# Altium schematic sheet STM32_MCU.SchDoc
size A2
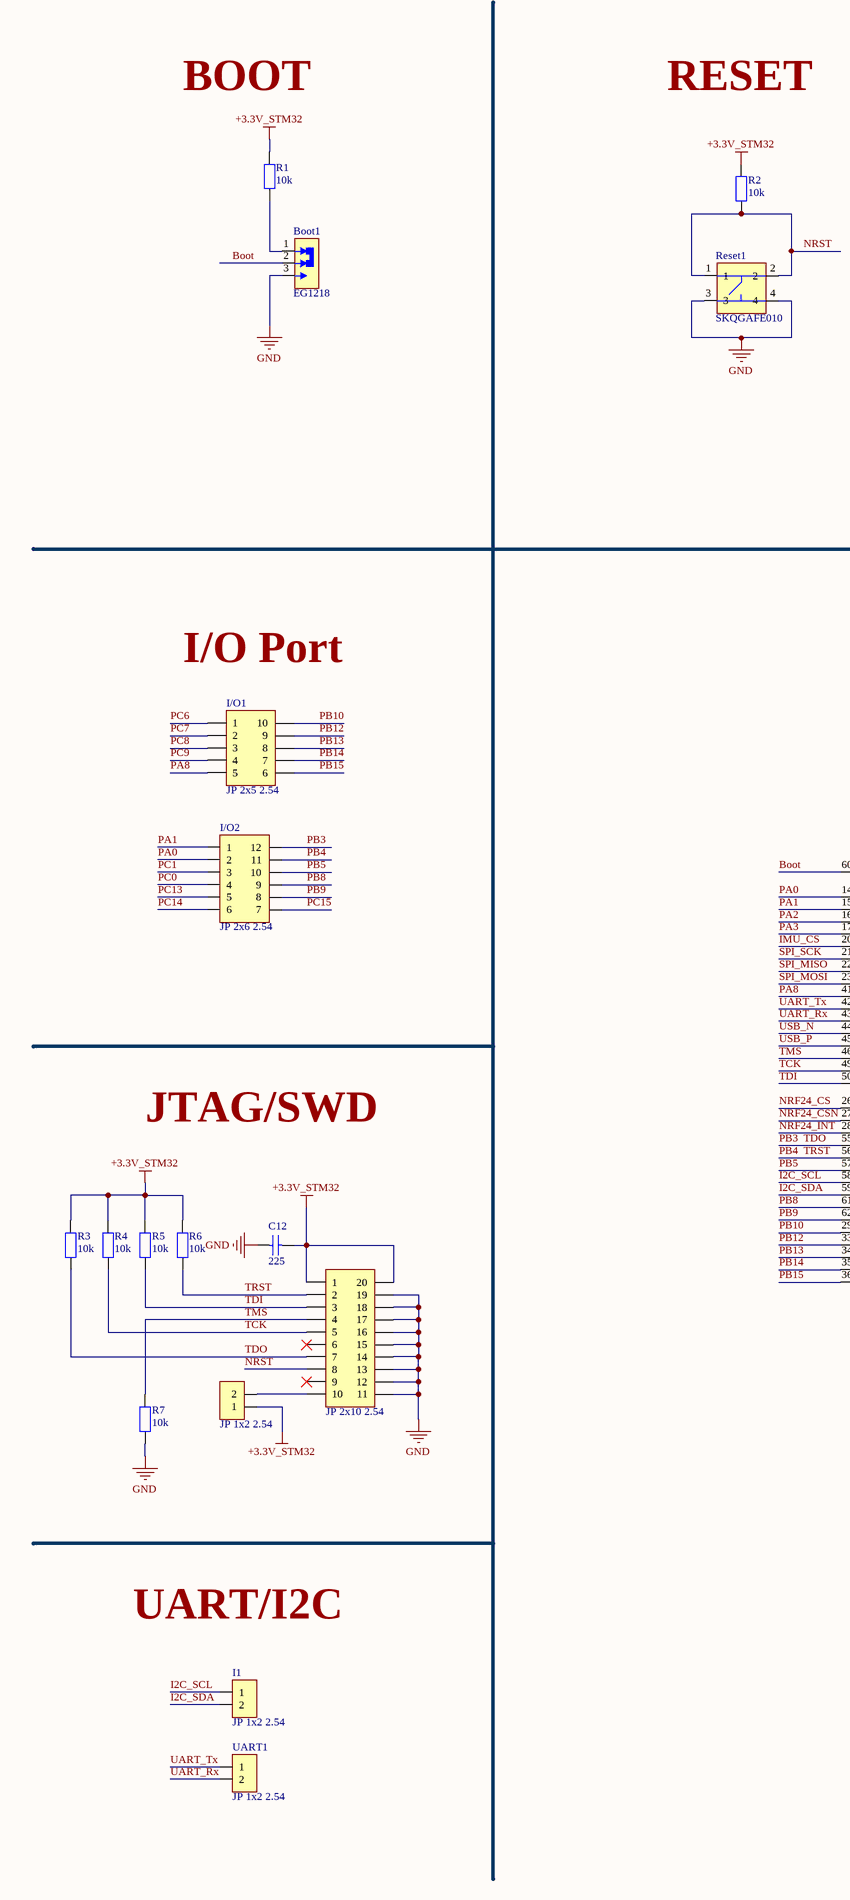
[diagram p0: STM32_MCU.SchDoc, left]
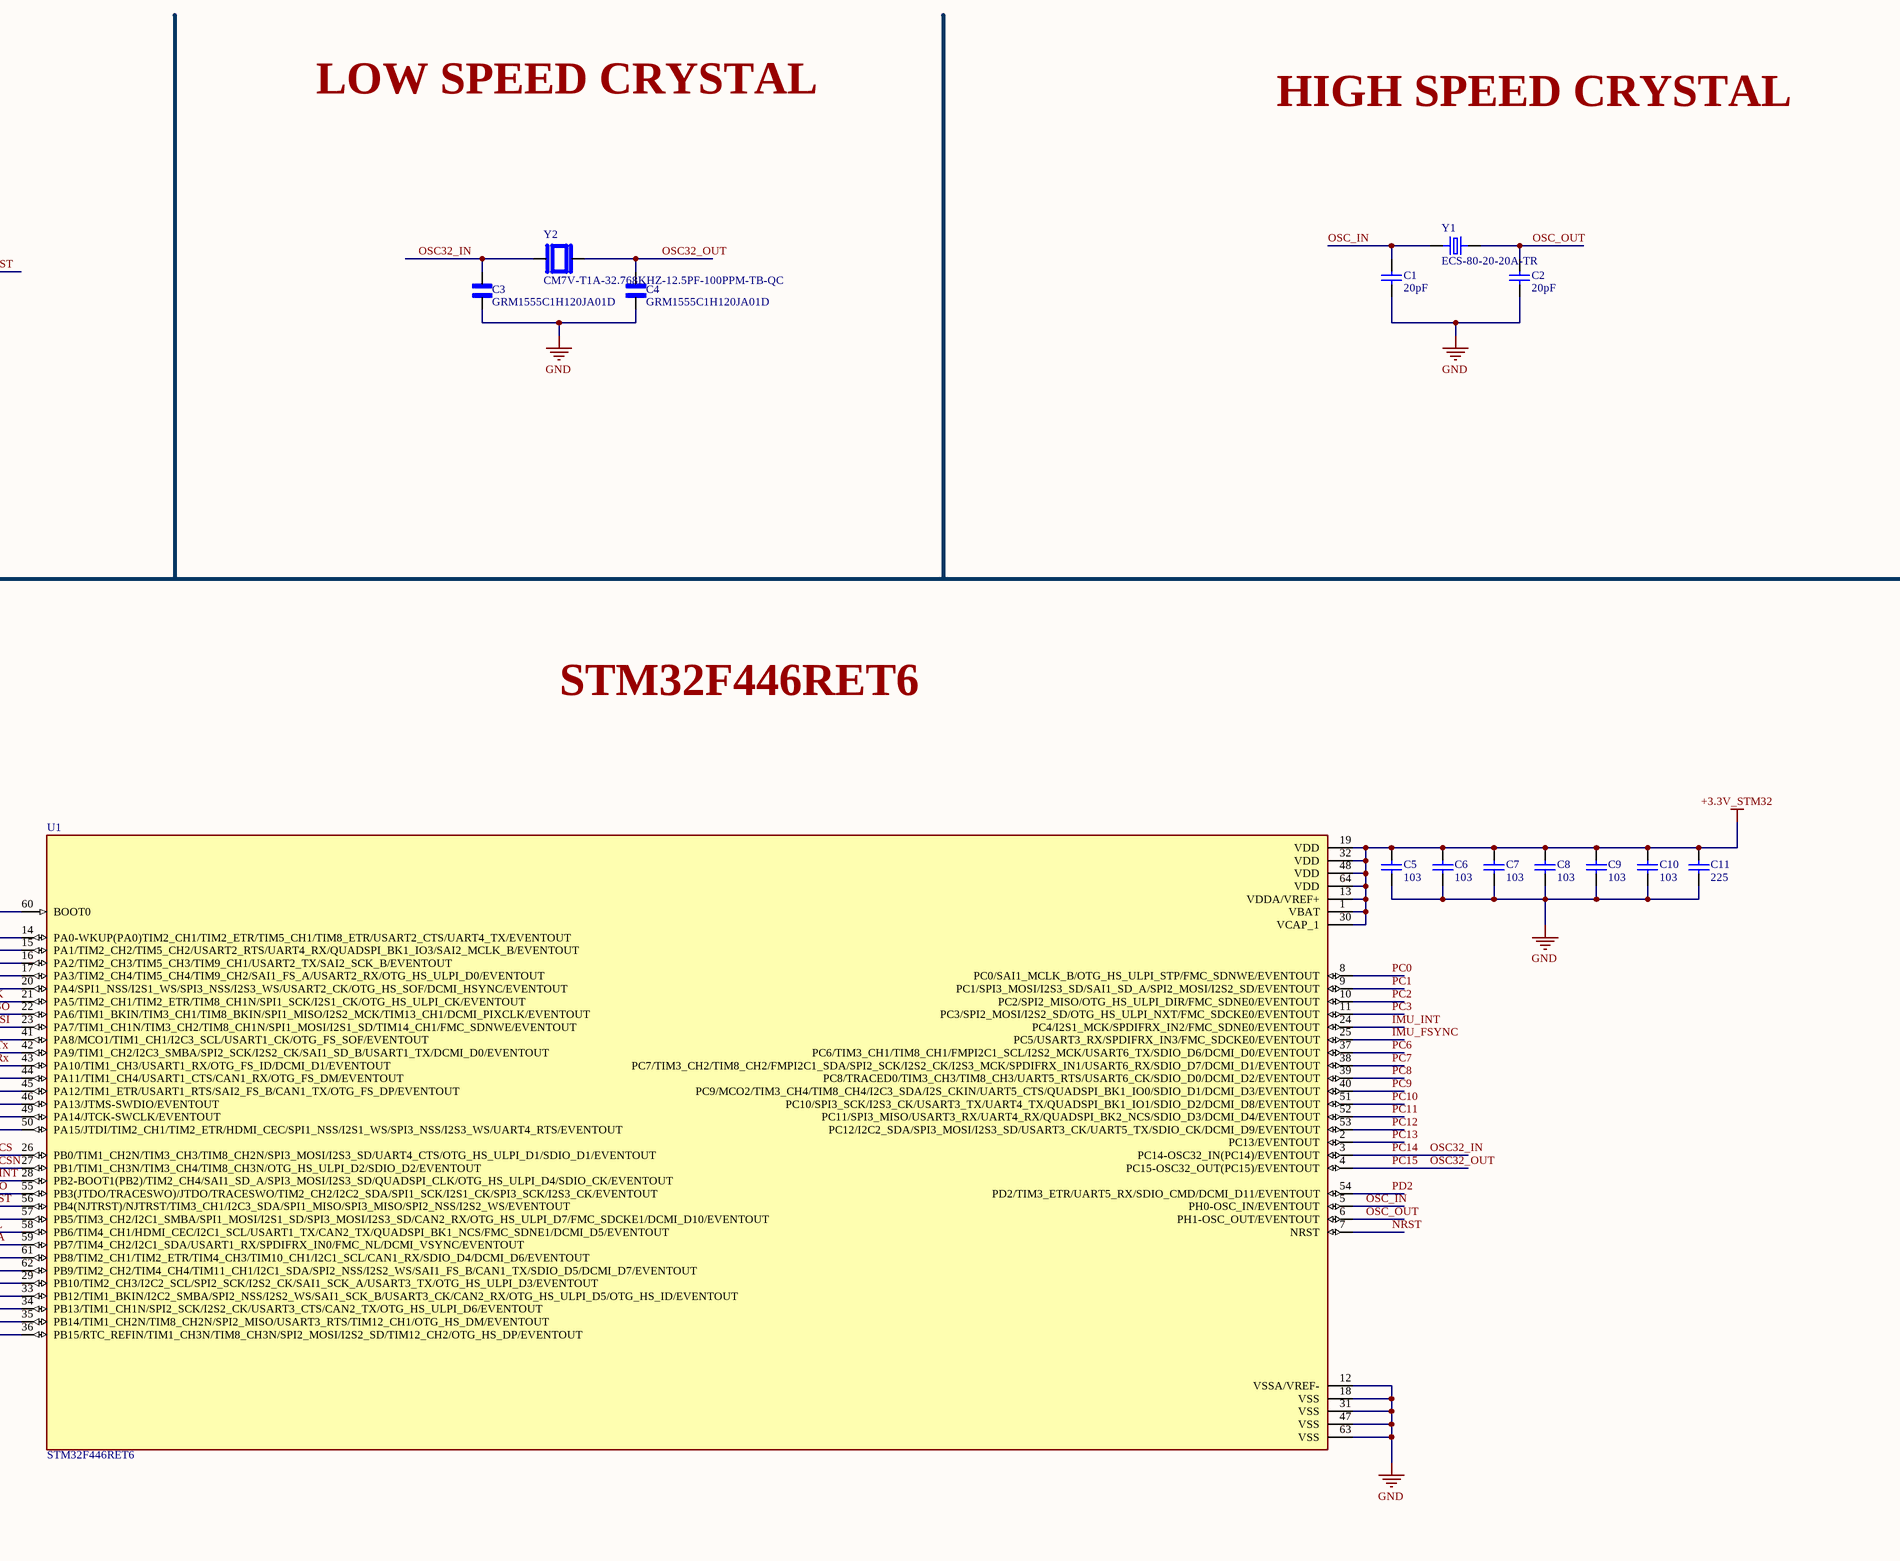
[diagram p1: STM32_MCU.SchDoc, right]

## Parts
Boot1  EG1218  [SW_EG1218]
C1  20pF  [tu 0805]
C2  20pF  [tu 0805]
C3  GRM1555C1H120JA01D  [CAPC1005X55N]
C4  GRM1555C1H120JA01D  [CAPC1005X55N]
C5  103  [tu 0603]
C6  103  [tu 0603]
C7  103  [tu 0603]
C8  103  [tu 0603]
C9  103  [tu 0603]
C10  103  [tu 0603]
C11  225  [tu 0805]
C12  225  [tu 0805]
I1  JP 1x2 2.54  [JP 1x2 DT]
I/O1  JP 2x5 2.54  [JP 2x5 DT]
I/O2  JP 2x6 2.54  [JP 2x6 DT]
JP1  JP 1x2 2.54  [JP 1x2 DT]
R1  10k  [tro smd 0603]
R2  10k  [tro smd 0603]
R3  10k  [tro smd 0603]
R4  10k  [tro smd 0603]
R5  10k  [tro smd 0603]
R6  10k  [tro smd 0603]
R7  10k  [tro smd 0603]
Reset1  SKQGAFE010  [SW_SKQGAFE010]
SWD/JTAG1  JP 2x10 2.54  [JP 2x10 DT]
U1  STM32F446RET6  [QFP50P1200X1200X160-64N]
UART1  JP 1x2 2.54  [JP 1x2 DT]
Y1  ECS-80-20-20A-TR  [XTAL_ECS-80-20-20A-TR]
Y2  CM7V-T1A-32.768KHZ-12.5PF-100PPM-TB-QC  [XTAL_CM7V-T1A-32.768KHZ-12.5PF-100PPM-TB-QC]

## Nets
+3.3V_STM32: C5.1 C6.1 C7.1 C8.1 C9.1 C10.1 C11.1 C12.1 JP1.1 R1.2 R2.2 R3.2 R4.2 R5.2 R6.2 SWD/JTAG1.1 SWD/JTAG1.20 U1.1(VBAT) U1.13(VDDA/VREF+) U1.19(VDD) U1.30(VCAP_1) U1.32(VDD) U1.48(VDD) U1.64(VDD)
GND: Boot1.3(NO) C1.2 C2.2 C3.1 C4.1 C5.2 C6.2 C7.2 C8.2 C9.2 C10.2 C11.2 C12.2 R7.1 Reset1.3 Reset1.4 SWD/JTAG1.11 SWD/JTAG1.12 SWD/JTAG1.13 SWD/JTAG1.14 SWD/JTAG1.15 SWD/JTAG1.16 SWD/JTAG1.17 SWD/JTAG1.18 SWD/JTAG1.19 U1.12(VSSA/VREF-) U1.18(VSS) U1.31(VSS) U1.47(VSS) U1.63(VSS)
Boot: Boot1.2(COM) U1.60(BOOT0)
I2C_SCL: I1.1 U1.58(PB6/TIM4_CH1/HDMI_CEC/I2C1_SCL/USART1_TX/CAN2_TX/QUADSPI_BK1_NCS/FMC_SDNE1/DCMI_D5/EVENTOUT)
I2C_SDA: I1.2 U1.59(PB7/TIM4_CH2/I2C1_SDA/USART1_RX/SPDIFRX_IN0/FMC_NL/DCMI_VSYNC/EVENTOUT)
IMU_CS: U1.20(PA4/SPI1_NSS/I2S1_WS/SPI3_NSS/I2S3_WS/USART2_CK/OTG_HS_SOF/DCMI_HSYNC/EVENTOUT)
IMU_FSYNC: U1.25(PC5/USART3_RX/SPDIFRX_IN3/FMC_SDCKE0/EVENTOUT)
IMU_INT: U1.24(PC4/I2S1_MCK/SPDIFRX_IN2/FMC_SDNE0/EVENTOUT)
NRF24_CS: U1.26(PB0/TIM1_CH2N/TIM3_CH3/TIM8_CH2N/SPI3_MOSI/I2S3_SD/UART4_CTS/OTG_HS_ULPI_D1/SDIO_D1/EVENTOUT)
NRF24_CSN: U1.27(PB1/TIM1_CH3N/TIM3_CH4/TIM8_CH3N/OTG_HS_ULPI_D2/SDIO_D2/EVENTOUT)
NRF24_INT: U1.28(PB2-BOOT1(PB2)/TIM2_CH4/SAI1_SD_A/SPI3_MOSI/I2S3_SD/QUADSPI_CLK/OTG_HS_ULPI_D4/SDIO_CK/EVENTOUT)
NRST: R2.1 Reset1.1 Reset1.2 SWD/JTAG1.8 U1.7(NRST)
OSC32_IN: C3.2 I/O2.6 U1.3(PC14-OSC32_IN(PC14)/EVENTOUT) Y2.1  [also labelled PC14]
OSC32_OUT: C4.2 I/O2.7 U1.4(PC15-OSC32_OUT(PC15)/EVENTOUT) Y2.2  [also labelled PC15]
OSC_IN: C1.1 U1.5(PH0-OSC_IN/EVENTOUT) Y1.1
OSC_OUT: C2.1 U1.6(PH1-OSC_OUT/EVENTOUT) Y1.2
PA0: I/O2.2 U1.14(PA0-WKUP(PA0)TIM2_CH1/TIM2_ETR/TIM5_CH1/TIM8_ETR/USART2_CTS/UART4_TX/EVENTOUT)
PA1: I/O2.1 U1.15(PA1/TIM2_CH2/TIM5_CH2/USART2_RTS/UART4_RX/QUADSPI_BK1_IO3/SAI2_MCLK_B/EVENTOUT)
PA2: U1.16(PA2/TIM2_CH3/TIM5_CH3/TIM9_CH1/USART2_TX/SAI2_SCK_B/EVENTOUT)
PA3: U1.17(PA3/TIM2_CH4/TIM5_CH4/TIM9_CH2/SAI1_FS_A/USART2_RX/OTG_HS_ULPI_D0/EVENTOUT)
PA8: I/O1.5 U1.41(PA8/MCO1/TIM1_CH1/I2C3_SCL/USART1_CK/OTG_FS_SOF/EVENTOUT)
PB3: I/O2.12 R3.1 SWD/JTAG1.7 U1.55(PB3(JTDO/TRACESWO)/JTDO/TRACESWO/TIM2_CH2/I2C2_SDA/SPI1_SCK/I2S1_CK/SPI3_SCK/I2S3_CK/EVENTOUT)  [also labelled TDO]
PB4: I/O2.11 R6.1 SWD/JTAG1.2 U1.56(PB4(NJTRST)/NJTRST/TIM3_CH1/I2C3_SDA/SPI1_MISO/SPI3_MISO/SPI2_NSS/I2S2_WS/EVENTOUT)  [also labelled TRST]
PB5: I/O2.10 U1.57(PB5/TIM3_CH2/I2C1_SMBA/SPI1_MOSI/I2S1_SD/SPI3_MOSI/I2S3_SD/CAN2_RX/OTG_HS_ULPI_D7/FMC_SDCKE1/DCMI_D10/EVENTOUT)
PB8: I/O2.9 U1.61(PB8/TIM2_CH1/TIM2_ETR/TIM4_CH3/TIM10_CH1/I2C1_SCL/CAN1_RX/SDIO_D4/DCMI_D6/EVENTOUT)
PB9: I/O2.8 U1.62(PB9/TIM2_CH2/TIM4_CH4/TIM11_CH1/I2C1_SDA/SPI2_NSS/I2S2_WS/SAI1_FS_B/CAN1_TX/SDIO_D5/DCMI_D7/EVENTOUT)
PB10: I/O1.10 U1.29(PB10/TIM2_CH3/I2C2_SCL/SPI2_SCK/I2S2_CK/SAI1_SCK_A/USART3_TX/OTG_HS_ULPI_D3/EVENTOUT)
PB12: I/O1.9 U1.33(PB12/TIM1_BKIN/I2C2_SMBA/SPI2_NSS/I2S2_WS/SAI1_SCK_B/USART3_CK/CAN2_RX/OTG_HS_ULPI_D5/OTG_HS_ID/EVENTOUT)
PB13: I/O1.8 U1.34(PB13/TIM1_CH1N/SPI2_SCK/I2S2_CK/USART3_CTS/CAN2_TX/OTG_HS_ULPI_D6/EVENTOUT)
PB14: I/O1.7 U1.35(PB14/TIM1_CH2N/TIM8_CH2N/SPI2_MISO/USART3_RTS/TIM12_CH1/OTG_HS_DM/EVENTOUT)
PB15: I/O1.6 U1.36(PB15/RTC_REFIN/TIM1_CH3N/TIM8_CH3N/SPI2_MOSI/I2S2_SD/TIM12_CH2/OTG_HS_DP/EVENTOUT)
PC0: I/O2.4 U1.8(PC0/SAI1_MCLK_B/OTG_HS_ULPI_STP/FMC_SDNWE/EVENTOUT)
PC1: I/O2.3 U1.9(PC1/SPI3_MOSI/I2S3_SD/SAI1_SD_A/SPI2_MOSI/I2S2_SD/EVENTOUT)
PC2: U1.10(PC2/SPI2_MISO/OTG_HS_ULPI_DIR/FMC_SDNE0/EVENTOUT)
PC3: U1.11(PC3/SPI2_MOSI/I2S2_SD/OTG_HS_ULPI_NXT/FMC_SDCKE0/EVENTOUT)
PC6: I/O1.1 U1.37(PC6/TIM3_CH1/TIM8_CH1/FMPI2C1_SCL/I2S2_MCK/USART6_TX/SDIO_D6/DCMI_D0/EVENTOUT)
PC7: I/O1.2 U1.38(PC7/TIM3_CH2/TIM8_CH2/FMPI2C1_SDA/SPI2_SCK/I2S2_CK/I2S3_MCK/SPDIFRX_IN1/USART6_RX/SDIO_D7/DCMI_D1/EVENTOUT)
PC8: I/O1.3 U1.39(PC8/TRACED0/TIM3_CH3/TIM8_CH3/UART5_RTS/USART6_CK/SDIO_D0/DCMI_D2/EVENTOUT)
PC9: I/O1.4 U1.40(PC9/MCO2/TIM3_CH4/TIM8_CH4/I2C3_SDA/I2S_CKIN/UART5_CTS/QUADSPI_BK1_IO0/SDIO_D1/DCMI_D3/EVENTOUT)
PC10: U1.51(PC10/SPI3_SCK/I2S3_CK/USART3_TX/UART4_TX/QUADSPI_BK1_IO1/SDIO_D2/DCMI_D8/EVENTOUT)
PC11: U1.52(PC11/SPI3_MISO/USART3_RX/UART4_RX/QUADSPI_BK2_NCS/SDIO_D3/DCMI_D4/EVENTOUT)
PC12: U1.53(PC12/I2C2_SDA/SPI3_MOSI/I2S3_SD/USART3_CK/UART5_TX/SDIO_CK/DCMI_D9/EVENTOUT)
PC13: I/O2.5 U1.2(PC13/EVENTOUT)
PD2: U1.54(PD2/TIM3_ETR/UART5_RX/SDIO_CMD/DCMI_D11/EVENTOUT)
SPI_MISO: U1.22(PA6/TIM1_BKIN/TIM3_CH1/TIM8_BKIN/SPI1_MISO/I2S2_MCK/TIM13_CH1/DCMI_PIXCLK/EVENTOUT)
SPI_MOSI: U1.23(PA7/TIM1_CH1N/TIM3_CH2/TIM8_CH1N/SPI1_MOSI/I2S1_SD/TIM14_CH1/FMC_SDNWE/EVENTOUT)
SPI_SCK: U1.21(PA5/TIM2_CH1/TIM2_ETR/TIM8_CH1N/SPI1_SCK/I2S1_CK/OTG_HS_ULPI_CK/EVENTOUT)
TCK: R4.1 SWD/JTAG1.5 U1.49(PA14/JTCK-SWCLK/EVENTOUT)
TDI: R5.1 SWD/JTAG1.3 U1.50(PA15/JTDI/TIM2_CH1/TIM2_ETR/HDMI_CEC/SPI1_NSS/I2S1_WS/SPI3_NSS/I2S3_WS/UART4_RTS/EVENTOUT)
TMS: R7.2 SWD/JTAG1.4 U1.46(PA13/JTMS-SWDIO/EVENTOUT)
UART_Rx: U1.43(PA10/TIM1_CH3/USART1_RX/OTG_FS_ID/DCMI_D1/EVENTOUT) UART1.2
UART_Tx: U1.42(PA9/TIM1_CH2/I2C3_SMBA/SPI2_SCK/I2S2_CK/SAI1_SD_B/USART1_TX/DCMI_D0/EVENTOUT) UART1.1
USB_N: U1.44(PA11/TIM1_CH4/USART1_CTS/CAN1_RX/OTG_FS_DM/EVENTOUT)
USB_P: U1.45(PA12/TIM1_ETR/USART1_RTS/SAI2_FS_B/CAN1_TX/OTG_FS_DP/EVENTOUT)
NetBoot1_1: Boot1.1(NC) R1.1
NetJP1_2: JP1.2 SWD/JTAG1.10

Not connected (* = marked no-connect by the designer): SWD/JTAG1 6* 9*

## Notes on the sheet
- BOOT
- RESET
- LOW SPEED CRYSTAL
- HIGH SPEED CRYSTAL
- I/O Port
- STM32F446RET6
- JTAG/SWD
- UART/I2C
- Title
- Size:
- Date:
- File:
- A2
- Number:
- Time:
- Revision:
- Sheet
- of

## Library data of the parts
Boot1 = EG1218: Slide Switch, EG Series, SPDT, Non-Shorting, ON-ON, 200mA DC, 30VDC, PC Pin | E-Switch EG1218; SnapEDA_Link: https://www.snapeda.com/parts/EG1218/E-Switch/view-part/?ref=snap; Package: None; Value: *; MF: E-Switch; MP: EG1218; Check_prices: https://www.snapeda.com/parts/EG1218/E-Switch/view-part/?ref=eda
C1 C2 = Tu 0805 20pF 50V 10%: Dán; Don_Vi: Con; Ten_Linh_Kien: Tụ 0805 20P 10% 50V; So_Chan: 2; Ma_Hang: MH004558; Chung_Loai: Dán; Kieu_Chan: *
C3 C4 = GRM1555C1H120JA01D: 0402 12 pF 50 V Â±5% Tolerance C0G SMT Multilayer Ceramic Capacitor; MF: {'manufacturer': u'Murata'}; Package: None; Price: None; Value: *; MP: GRM1555C1H120JA01D; Availability: Unavailable
C5-C10 = Tu 0603 103 50V 10%: Dán; Don_Vi: Con; So_Chan: 2; Ten_Linh_Kien: Tụ 0603 103-10nF 10% 50V; Ma_Hang: MH004567; Chung_Loai: Dán; Kieu_Chan: *
C11 C12 = Tu 0805 225 25V 10%: Dán; Don_Vi: Con; So_Chan: 2; Ten_Linh_Kien: Tụ 0805 225-2.2uF 25V 10%; Ma_Hang: MH007483; Chung_Loai: Dán; Kieu_Chan: *
I1 JP1 UART1 = JP 1x2 2.54 Duc Thang: Cắm; Ten_Linh_Kien: Jump Đơn Đực 2.54MM 1x40P Thẳng 11MM; Don_Vi: Con; Ma_Hang: MH000903; Ghi_Chu: *; Kieu_Chan: *; Chung_Loai: Cắm
I/O1 = JP 2x5 2.54 Duc Thang: Cắm; Ten_Linh_Kien: Jump Đôi Đực 2.54MM 2x40P Thẳng 11MM; Don_Vi: Con; Ma_Hang: MH002686; Ghi_Chu: *; Kieu_Chan: *; Chung_Loai: Cắm
I/O2 = JP 2x6 2.54 Duc Thang: Cắm; Ten_Linh_Kien: Jump Đôi Đực 2.54MM 2x40P Thẳng 11MM; Don_Vi: Con; Ma_Hang: MH002686; Ghi_Chu: *; Kieu_Chan: *; Chung_Loai: Cắm
R1-R7 = Tro 0603 1% 10k: Dán; Don_Vi: Con; So_Chan: 2; Ten_Linh_Kien: Trở 0603 1% 10k; Ma_Hang: MH006333; Chung_Loai: Dán; Kieu_Chan: *
Reset1 = SKQGAFE010: Switch Tactile N.O. SPST Button Gull Wing 0.05A 12VDC 0.98N SMD T/R; MF: {'manufacturer': u'ALPS'}; Package: None; Price: None; Value: *; MP: SKQGAFE010; Availability: Unavailable
SWD/JTAG1 = JP 2x10 2.54 Duc Thang: Cắm; Ten_Linh_Kien: Jump Đôi Đực 2.54MM 2x40P Thẳng 11MM; Don_Vi: Con; Ma_Hang: MH002686; Ghi_Chu: *; Kieu_Chan: *; Chung_Loai: Cắm
U1 = STM32F446RET6: MCU 32-Bit STM32 ARM Cortex M4 RISC 512KB Flash 2.5V/3.3V 64-Pin LQFP Tray; MF: {'manufacturer': u'STMicroelectronics'}; Package: None; Price: None; Value: *; MP: STM32F446RET6; Availability: Unavailable
Y1 = ECS-80-20-20A-TR: SMD CRYSTAL; MF: {'manufacturer': u'ECS Inc.'}; Package: None; Price: None; Value: *; MP: ECS-80-20-20A-TR; Availability: Unavailable
Y2 = CM7V-T1A-32.768KHZ-12.5PF-100PPM-TB-QC: MF: {'manufacturer': u'Micro Crystal'}; Package: None; Price: None; Value: *; MP: CM7V-T1A-32.768KHZ-12.5PF-100PPM-TB-QC; Availability: Unavailable